# EAGLE design schematic (EAGLE 6.4)
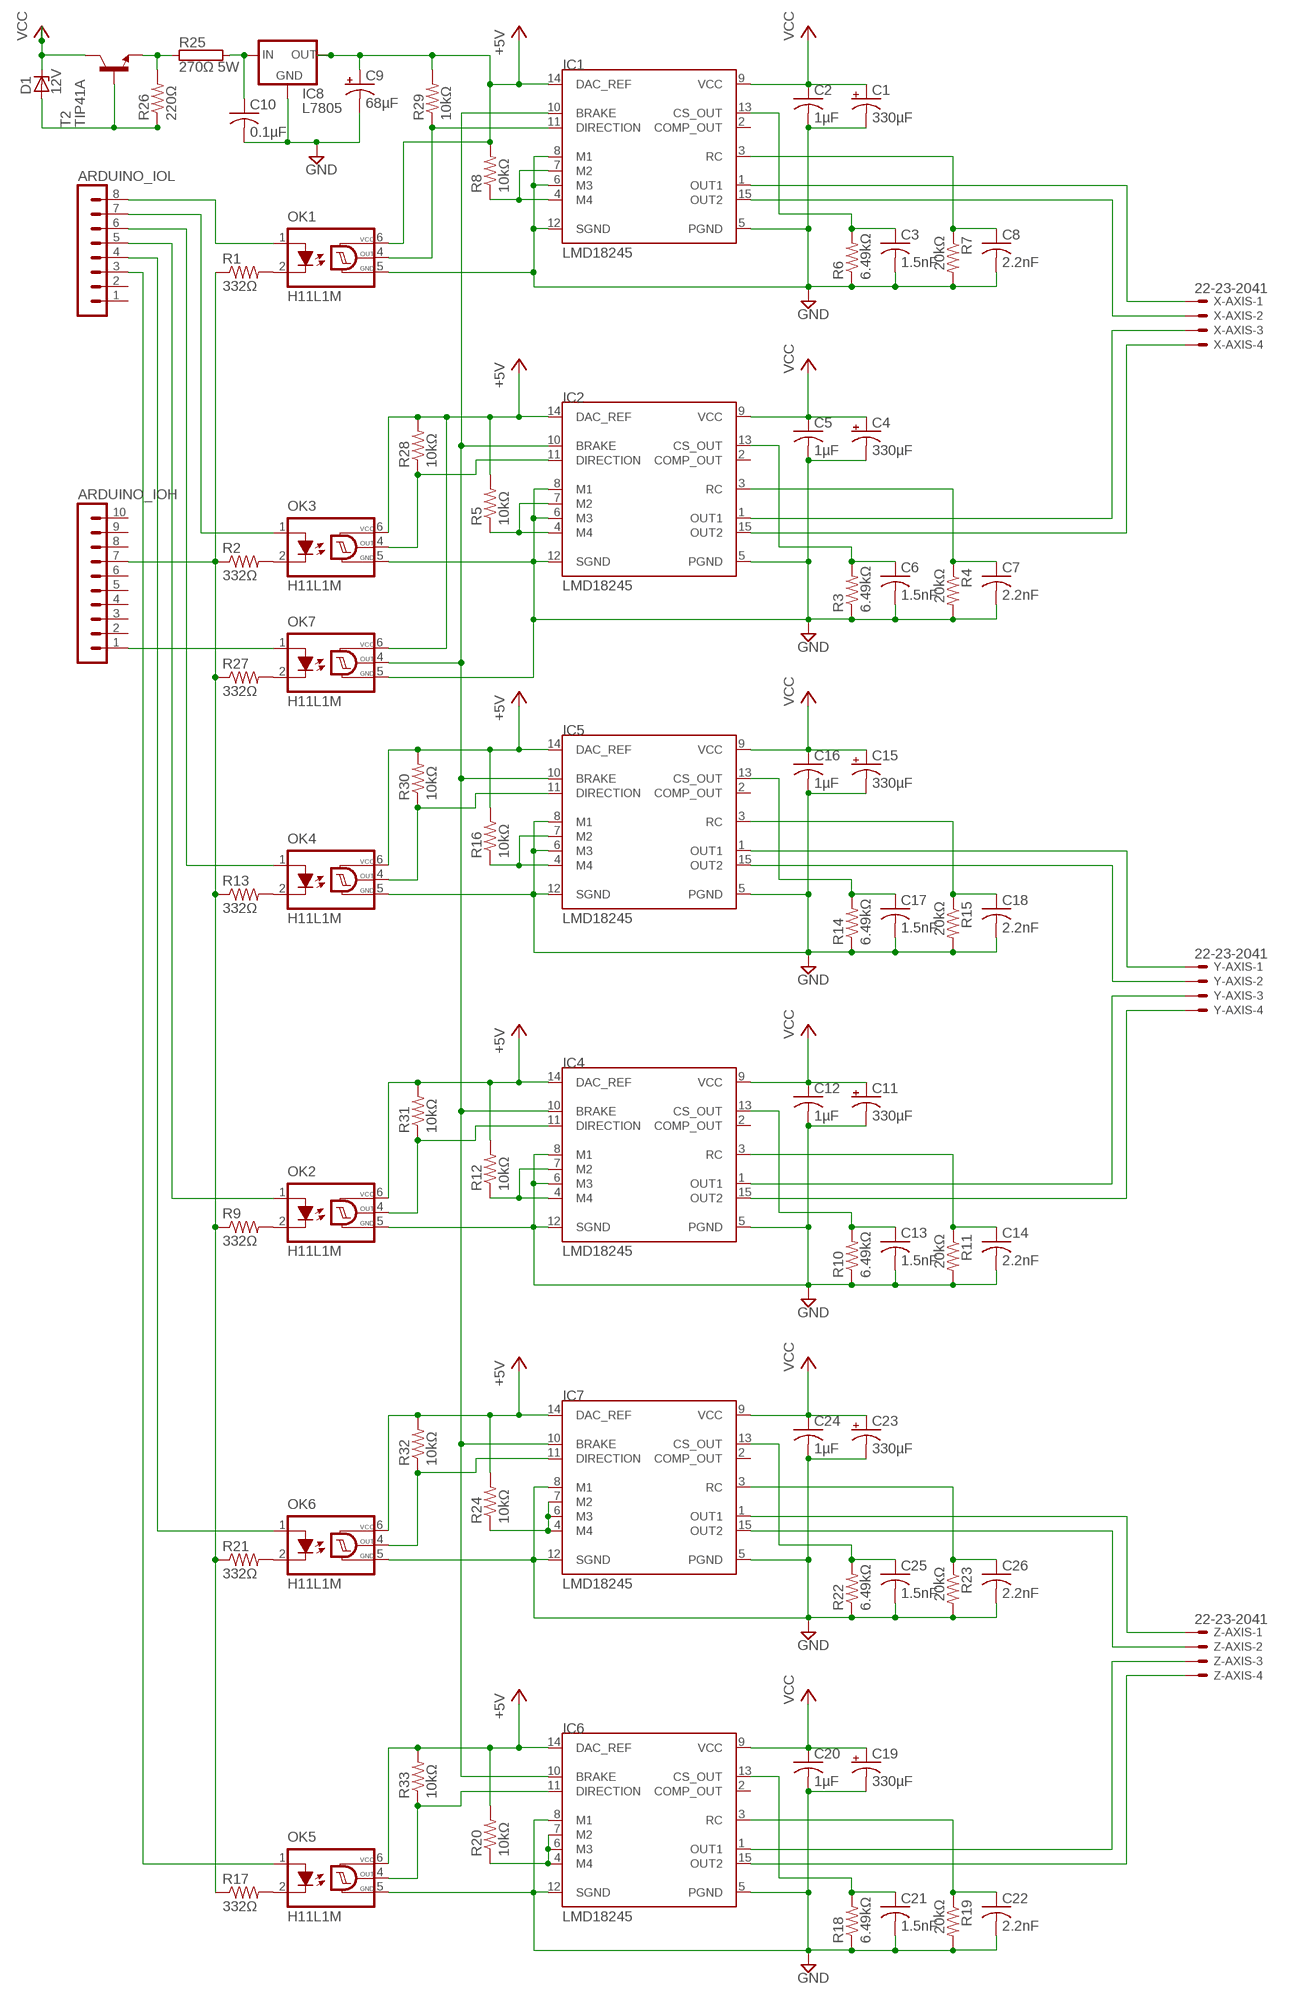
[diagram p0: schematic, sheet 1]

## Parts
ARDUINO_IOH  MA10-1  [MA10-1]
ARDUINO_IOL  MA08-1  [MA08-1]
C1  330µF  CPOL-USE5-13  [E5-13]
C2  1µF  C-US050-024X044  [C050-024X044]
C3  1.5nF  C-US050-024X044  [C050-024X044]
C4  330µF  CPOL-USE5-13  [E5-13]
C5  1µF  C-US050-024X044  [C050-024X044]
C6  1.5nF  C-US050-024X044  [C050-024X044]
C7  2.2nF  C-US050-024X044  [C050-024X044]
C8  2.2nF  C-US050-024X044  [C050-024X044]
C9  68µF  CPOL-USE2.5-6  [E2,5-6]
C10  0.1µF  C-US102-054X133  [C102-054X133]
C11  330µF  CPOL-USE5-13  [E5-13]
C12  1µF  C-US050-024X044  [C050-024X044]
C13  1.5nF  C-US050-024X044  [C050-024X044]
C14  2.2nF  C-US050-024X044  [C050-024X044]
C15  330µF  CPOL-USE5-13  [E5-13]
C16  1µF  C-US050-024X044  [C050-024X044]
C17  1.5nF  C-US050-024X044  [C050-024X044]
C18  2.2nF  C-US050-024X044  [C050-024X044]
C19  330µF  CPOL-USE5-13  [E5-13]
C20  1µF  C-US050-024X044  [C050-024X044]
C21  1.5nF  C-US050-024X044  [C050-024X044]
C22  2.2nF  C-US050-024X044  [C050-024X044]
C23  330µF  CPOL-USE5-13  [E5-13]
C24  1µF  C-US050-024X044  [C050-024X044]
C25  1.5nF  C-US050-024X044  [C050-024X044]
C26  2.2nF  C-US050-024X044  [C050-024X044]
D1  12V  ZPY  [DO41Z10]
IC1  LMD18245  [MULTIWATT-15]
IC2  LMD18245  [MULTIWATT-15]
IC4  LMD18245  [MULTIWATT-15]
IC5  LMD18245  [MULTIWATT-15]
IC6  LMD18245  [MULTIWATT-15]
IC7  LMD18245  [MULTIWATT-15]
IC8  L7805  78XXS  [78XXS]
OK1  H11L1M  [DIL06]
OK2  H11L1M  [DIL06]
OK3  H11L1M  [DIL06]
OK4  H11L1M  [DIL06]
OK5  H11L1M  [DIL06]
OK6  H11L1M  [DIL06]
OK7  H11L1M  [DIL06]
R1  332Ω  R-US_0204/7  [0204/7]
R2  332Ω  R-US_0204/7  [0204/7]
R3  6.49kΩ  R-US_0204/7  [0204/7]
R4  20kΩ  R-US_0204/7  [0204/7]
R5  10kΩ  R-US_0204/7  [0204/7]
R6  6.49kΩ  R-US_0204/7  [0204/7]
R7  20kΩ  R-US_0204/7  [0204/7]
R8  10kΩ  R-US_0204/7  [0204/7]
R9  332Ω  R-US_0204/7  [0204/7]
R10  6.49kΩ  R-US_0204/7  [0204/7]
R11  20kΩ  R-US_0204/7  [0204/7]
R12  10kΩ  R-US_0204/7  [0204/7]
R13  332Ω  R-US_0204/7  [0204/7]
R14  6.49kΩ  R-US_0204/7  [0204/7]
R15  20kΩ  R-US_0204/7  [0204/7]
R16  10kΩ  R-US_0204/7  [0204/7]
R17  332Ω  R-US_0204/7  [0204/7]
R18  6.49kΩ  R-US_0204/7  [0204/7]
R19  20kΩ  R-US_0204/7  [0204/7]
R20  10kΩ  R-US_0204/7  [0204/7]
R21  332Ω  R-US_0204/7  [0204/7]
R22  6.49kΩ  R-US_0204/7  [0204/7]
R23  20kΩ  R-US_0204/7  [0204/7]
R24  10kΩ  R-US_0204/7  [0204/7]
R25  270Ω 5W  RHPS523  [HPS523]
R26  220Ω  R-US_0204/7  [0204/7]
R27  332Ω  R-US_0204/7  [0204/7]
R28  10kΩ  R-US_0204/7  [0204/7]
R29  10kΩ  R-US_0204/7  [0204/7]
R30  10kΩ  R-US_0204/7  [0204/7]
R31  10kΩ  R-US_0204/7  [0204/7]
R32  10kΩ  R-US_0204/7  [0204/7]
R33  10kΩ  R-US_0204/7  [0204/7]
T2  TIP41A  -NPN-TO202V  [TO202V]
X-AXIS  22-23-2041  [22-23-2041]
Y-AXIS  22-23-2041  [22-23-2041]
Z-AXIS  22-23-2041  [22-23-2041]

## Nets
+5V: C9.+ IC1.14(DAC_REF) IC2.14(DAC_REF) IC4.14(DAC_REF) IC5.14(DAC_REF) IC6.14(DAC_REF) IC7.14(DAC_REF) IC8.OUT OK1.6(VCC) OK2.6(VCC) OK3.6(VCC) OK4.6(VCC) OK5.6(VCC) OK6.6(VCC) OK7.6(VCC) R5.2 R8.2 R12.2 R16.2 R20.2 R24.2 R28.2 R29.2 R30.2 R31.2 R32.2 R33.2
GND: C1.- C2.2 C3.2 C4.- C5.2 C6.2 C7.2 C8.2 C9.- C10.2 C11.- C12.2 C13.2 C14.2 C15.- C16.2 C17.2 C18.2 C19.- C20.2 C21.2 C22.2 C23.- C24.2 C25.2 C26.2 IC1.5(PGND) IC1.6(M3) IC1.8(M1) IC1.12(SGND) IC2.5(PGND) IC2.6(M3) IC2.8(M1) IC2.12(SGND) IC4.5(PGND) IC4.6(M3) IC4.8(M1) IC4.12(SGND) IC5.5(PGND) IC5.6(M3) IC5.8(M1) IC5.12(SGND) IC6.5(PGND) IC6.8(M1) IC6.12(SGND) IC7.5(PGND) IC7.8(M1) IC7.12(SGND) IC8.GND OK1.5(GND) OK2.5(GND) OK3.5(GND) OK4.5(GND) OK5.5(GND) OK6.5(GND) OK7.5(GND) R3.1 R4.2 R6.1 R7.2 R10.1 R11.2 R14.1 R15.2 R18.1 R19.2 R22.1 R23.2
N$1: ARDUINO_IOH.7 R1.1 R2.1 R9.1 R13.1 R17.1 R21.1 R27.1
N$2: IC1.11(DIRECTION) OK1.4(OUT) R29.1
N$3: ARDUINO_IOL.8 OK1.1(A)
N$4: IC4.11(DIRECTION) OK2.4(OUT) R31.1
N$5: C3.1 IC1.13(CS_OUT) R6.2
N$6: IC2.4(M4) IC2.7(M2) R5.1
N$7: C8.1 IC1.3(RC) R7.1
N$8: IC1.4(M4) IC1.7(M2) R8.1
N$9: IC7.11(DIRECTION) OK6.4(OUT) R32.1
N$10: C6.1 IC2.13(CS_OUT) R3.2
N$11: ARDUINO_IOL.7 OK3.1(A)
N$12: C7.1 IC2.3(RC) R4.1
N$13: C13.1 IC4.13(CS_OUT) R10.2
N$14: C14.1 IC4.3(RC) R11.1
N$15: IC1.1(OUT1) X-AXIS.1
N$16: IC1.15(OUT2) X-AXIS.2
N$17: IC2.1(OUT1) X-AXIS.3
N$18: IC4.4(M4) IC4.7(M2) R12.1
N$19: IC5.11(DIRECTION) OK4.4(OUT) R30.1
N$20: IC2.15(OUT2) X-AXIS.4
N$21: OK3.2(C) R2.2
N$22: OK1.2(C) R1.2
N$23: C17.1 IC5.13(CS_OUT) R14.2
N$24: C18.1 IC5.3(RC) R15.1
N$25: IC5.4(M4) IC5.7(M2) R16.1
N$26: IC5.1(OUT1) Y-AXIS.1
N$27: IC5.15(OUT2) Y-AXIS.2
N$28: IC4.1(OUT1) Y-AXIS.3
N$29: IC4.15(OUT2) Y-AXIS.4
N$30: ARDUINO_IOL.5 OK2.1(A)
N$31: IC7.4(M4) IC7.6(M3) IC7.7(M2) R24.1
N$32: OK2.2(C) R9.2
N$33: OK4.2(C) R13.2
N$34: ARDUINO_IOL.6 OK4.1(A)
N$35: IC6.11(DIRECTION) OK5.4(OUT) R33.1
N$36: C21.1 IC6.13(CS_OUT) R18.2
N$37: C22.1 IC6.3(RC) R19.1
N$38: IC6.4(M4) IC6.6(M3) IC6.7(M2) R20.1
N$40: C25.1 IC7.13(CS_OUT) R22.2
N$41: C26.1 IC7.3(RC) R23.1
N$42: D1.A R26.1 T2.3(B)
N$43: IC7.1(OUT1) Z-AXIS.1
N$44: IC7.15(OUT2) Z-AXIS.2
N$45: IC6.1(OUT1) Z-AXIS.3
N$46: IC6.15(OUT2) Z-AXIS.4
N$47: ARDUINO_IOL.3 OK5.1(A)
N$48: R25.1 R26.2 T2.1(E)
N$49: OK5.2(C) R17.2
N$50: OK6.2(C) R21.2
N$51: ARDUINO_IOL.4 OK6.1(A)
N$52: C10.1 IC8.IN R25.2
N$53: OK7.2(C) R27.2
N$54: ARDUINO_IOH.1 OK7.1(A)
N$55: IC1.10(BRAKE) IC4.10(BRAKE) IC5.10(BRAKE) IC6.10(BRAKE) IC7.10(BRAKE) OK7.4(OUT)
N$56: IC2.11(DIRECTION) OK3.4(OUT) R28.1
VCC: C1.+ C2.1 C4.+ C5.1 C11.+ C12.1 C15.+ C16.1 C19.+ C20.1 C23.+ C24.1 D1.C IC1.9(VCC) IC2.9(VCC) IC4.9(VCC) IC5.9(VCC) IC6.9(VCC) IC7.9(VCC) T2.2(C)
Unconnected: ARDUINO_IOH.2 ARDUINO_IOH.3 ARDUINO_IOH.4 ARDUINO_IOH.5 ARDUINO_IOH.6 ARDUINO_IOH.8 ARDUINO_IOH.9 ARDUINO_IOH.10 ARDUINO_IOL.1 ARDUINO_IOL.2 IC1.2(COMP_OUT) IC2.2(COMP_OUT) IC2.10(BRAKE) IC4.2(COMP_OUT) IC5.2(COMP_OUT) IC6.2(COMP_OUT) IC7.2(COMP_OUT)

## Library data of the parts
ARDUINO_IOH = con-lstb:MA10-1: PIN HEADER; OC_FARNELL: unknown; OC_NEWARK: unknown
ARDUINO_IOL = con-lstb:MA08-1: PIN HEADER; OC_FARNELL: unknown; OC_NEWARK: unknown
C1 C4 C9 C11 C15 C19 C23 = resistor:CPOL-US: POLARIZED CAPACITOR, American symbol
C2 C3 C5-C8 C10 C12-C14 C16-C18 C20-C22 C24-C26 = resistor:C-US: CAPACITOR, American symbol
D1 = diode:ZPY: Z DIODE 1 W
IC1 IC2 IC4-IC7 = eagleLibrary:LMD18245: LMD18245 3A, 55V DMOS Full-Bridge Motor Driver; MF: Texas Instruments; MPN: LMD18245; OC_FARNELL: 1589425; OC_NEWARK: 32M1527
IC8 = v-reg:78XXS: VOLTAGE REGULATOR
OK1-OK7 = optocoupler:H11L*M: 6-Pin DIP Optocoupler Source: http://www.fairchildsemi.com/ds/H1/H11L2-M.pdf; MF: FAIRCHILD SEMICONDUCTOR; MPN: H11L1-M; OC_FARNELL: 1021127; OC_NEWARK: 72K8643
R1-R24 R26-R33 = resistor:R-US_: RESISTOR, American symbol
R25 = resistor-power:R: Power Resitor; OC_FARNELL: unknown; OC_NEWARK: unknown
T2 = transistor:*-NPN-: NPN Transistror BF959 corrected 2008.03.06
X-AXIS Y-AXIS Z-AXIS = con-molex:22-23-2041: .100" (2.54mm) Center Header - 4 Pin; MF: MOLEX; MPN: 22-23-2041; OC_FARNELL: 1462920; OC_NEWARK: 38C0355

## Board
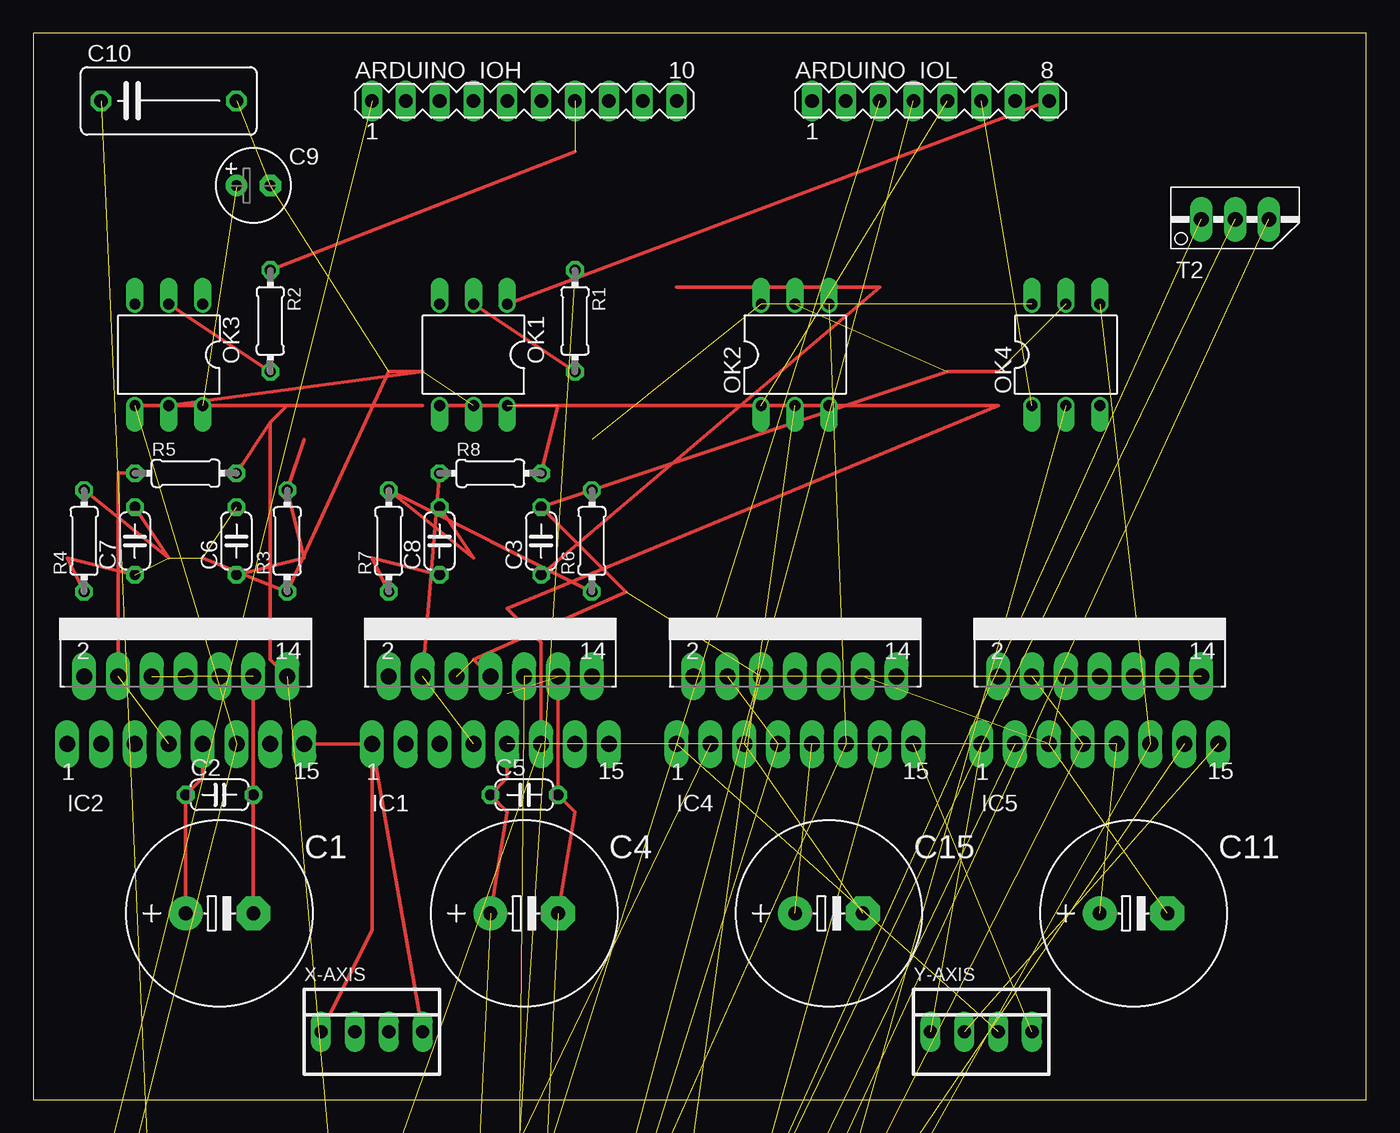
[diagram p1: board, top side]
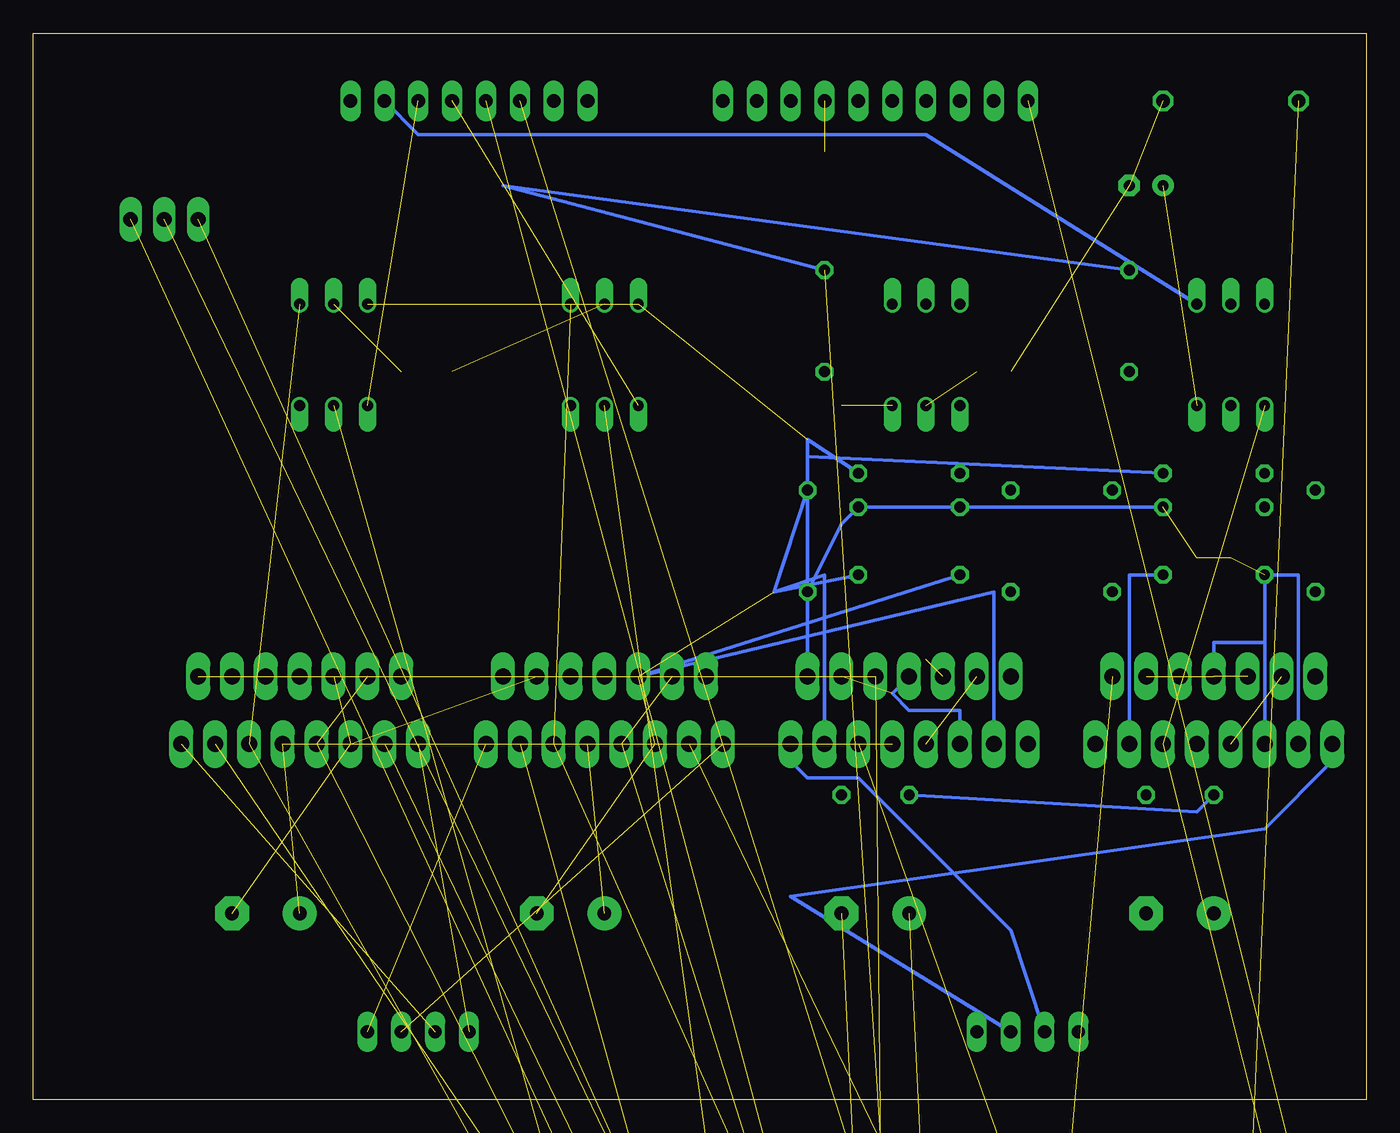
[diagram p2: board, bottom side, seen from below]

Size 100 x 80 mm. Coordinates in mm from the lower left corner, seen from the top.
Outline: 0,0 100,0 100,80 0,80 0,0
Copper layers (1*16): Top 0.035mm / dielectric 1.5mm / Bottom 0.035mm
Design rules "default": minimum track width 10mil, minimum drill 24mil, track to track 8mil, track to pad 8mil, pad to pad 8mil, via to via 8mil, smd to smd 8mil, copper to edge 40mil, drill to drill 8mil, minimum pad ring 10mil, minimum via ring 8mil, stop-mask expansion 4mil, vias tented up to drill 0mil, thermal gap 10mil

### Footprints (pad centres in the part's own frame; a part is rotated, then mirrored left to right if it is on the bottom)
MA10-1 = drill 1.016 long: 1 -11.43,0; 2 -8.89,0; 3 -6.35,0; 4 -3.81,0; 5 -1.27,0; 6 1.27,0; 7 3.81,0; 8 6.35,0; 9 8.89,0; 10 11.43,0
MA08-1 = drill 1.016 long: 1 -8.89,0; 2 -6.35,0; 3 -3.81,0; 4 -1.27,0; 5 1.27,0; 6 3.81,0; 7 6.35,0; 8 8.89,0
E5-13 = drill 1.016 pad 2.54: + -2.54,0 | drill 1.016 pad 2.54 octagon: - 2.54,0
C050-024X044 = drill 0.813 octagon: 1 -2.54,0; 2 2.54,0
E2,5-6 = drill 0.813 pad 1.6: + -1.27,0 | drill 0.813 pad 1.6 octagon: - 1.27,0
C102-054X133 = drill 1.016 octagon: 1 -5.08,0; 2 5.08,0
DO41Z10 = drill 1.118: A 5.08,0; C -5.08,0
MULTIWATT-15 = drill 1.2 long: 1 -8.89,-7.62; 2 -7.62,-2.54; 3 -6.35,-7.62; 4 -5.08,-2.54; 5 -3.81,-7.62; 6 -2.54,-2.54; 7 -1.27,-7.62; 8 0,-2.54; 9 1.27,-7.62; 10 2.54,-2.54; 11 3.81,-7.62; 12 5.08,-2.54; 13 6.35,-7.62; 14 7.62,-2.54; 15 8.89,-7.62
78XXS = drill 1.016 long: GND 0,-2.54; IN -2.54,-2.54; OUT 2.54,-2.54
DIL06 = drill 0.813 offset: 1 -2.54,-3.81; 2 0,-3.81; 3 2.54,-3.81; 4 2.54,3.81; 5 0,3.81; 6 -2.54,3.81
0204/7 = drill 0.813 octagon: 1 -3.81,0; 2 3.81,0
HPS523 = drill 1.1 pad 1.7: 1 -13.97,0; 2 13.97,0
TO202V = drill 1.118 long: 1 -2.54,-2.54; 2 0,-2.54; 3 2.54,-2.54
22-23-2041 = drill 1 long: 1 -3.81,0; 2 -1.27,0; 3 1.27,0; 4 3.81,0

### Placement (x,y rotation side)
ARDUINO_IOH  36.83,74.93 0 top
ARDUINO_IOL  67.31,74.93 0 top
C1  13.97,13.97 0 top
C2  13.97,22.86 0 top
C3  38.1,41.91 90 top
C4  36.83,13.97 0 top
C5  36.83,22.86 0 top
C6  15.24,41.91 90 top
C7  7.62,41.91 90 top
C8  30.48,41.91 90 top
C9  16.51,68.58 0 top
C10  10.16,74.93 0 top
C11  82.55,13.97 0 top
C12  33.02,-64.77 0 top  (outside the outline)
C13  40.64,-64.77 0 top  (outside the outline)
C14  3.81,-76.2 0 top  (outside the outline)
C15  59.69,13.97 0 top
C16  11.43,-76.2 0 top  (outside the outline)
C17  19.05,-76.2 0 top  (outside the outline)
C18  26.67,-76.2 0 top  (outside the outline)
C19  6.35,-123.19 0 top  (outside the outline)
C20  33.02,-120.65 0 top  (outside the outline)
C21  40.64,-120.65 0 top  (outside the outline)
C22  3.81,-132.08 0 top  (outside the outline)
C23  20.32,-123.19 0 top  (outside the outline)
C24  11.43,-132.08 0 top  (outside the outline)
C25  19.05,-132.08 0 top  (outside the outline)
C26  26.67,-132.08 0 top  (outside the outline)
D1  -7.62,-147.32 0 top  (outside the outline)
IC1  34.29,34.29 0 top
IC2  11.43,34.29 0 top
IC4  57.15,34.29 0 top
IC5  80.01,34.29 0 top
IC6  10.16,-90.17 0 top  (outside the outline)
IC7  33.02,-90.17 0 top  (outside the outline)
IC8  -33.02,-200.66 0 top  (outside the outline)
OK1  33.02,55.88 180 top
OK2  57.15,55.88 0 top
OK3  10.16,55.88 180 top
OK4  77.47,55.88 0 top
OK5  6.35,-110.49 0 top  (outside the outline)
OK6  17.78,-110.49 0 top  (outside the outline)
OK7  -33.02,-165.1 0 top  (outside the outline)
R1  40.64,58.42 270 top
R2  17.78,58.42 270 top
R3  19.05,41.91 90 top
R4  3.81,41.91 90 top
R5  11.43,46.99 0 top
R6  41.91,41.91 90 top
R7  26.67,41.91 90 top
R8  34.29,46.99 0 top
R9  35.56,-76.2 0 top  (outside the outline)
R10  5.08,-82.55 0 top  (outside the outline)
R11  15.24,-82.55 0 top  (outside the outline)
R12  25.4,-82.55 0 top  (outside the outline)
R13  35.56,-82.55 0 top  (outside the outline)
R14  5.08,-86.36 0 top  (outside the outline)
R15  15.24,-86.36 0 top  (outside the outline)
R16  25.4,-86.36 0 top  (outside the outline)
R17  35.56,-132.08 0 top  (outside the outline)
R18  5.08,-138.43 0 top  (outside the outline)
R19  15.24,-138.43 0 top  (outside the outline)
R20  25.4,-138.43 0 top  (outside the outline)
R21  35.56,-138.43 0 top  (outside the outline)
R22  5.08,-142.24 0 top  (outside the outline)
R23  15.24,-142.24 0 top  (outside the outline)
R24  25.4,-142.24 0 top  (outside the outline)
R25  1.27,-156.21 0 top  (outside the outline)
R26  -8.89,-162.56 0 top  (outside the outline)
R27  -33.02,-176.53 0 top  (outside the outline)
R28  -33.02,-180.34 0 top  (outside the outline)
R29  -33.02,-184.15 0 top  (outside the outline)
R30  -33.02,-187.96 0 top  (outside the outline)
R31  -33.02,-191.77 0 top  (outside the outline)
R32  -33.02,-195.58 0 top  (outside the outline)
R33  -33.02,-199.39 0 top  (outside the outline)
T2  90.17,68.58 0 top
X-AXIS  25.4,5.08 0 top
Y-AXIS  71.12,5.08 0 top
Z-AXIS  29.21,-109.22 0 top  (outside the outline)

### Tracks (layer width: path | path; a pad name or v marks a point on that pad's centre or on a via)
+5V  (22 unrouted)
  Top 0.254: 17.78,50.8 19.05,52.07 OK3.6 | 17.78,50.8 R5.2 | IC2.14 17.78,33.02 17.78,50.8 | 39.37,52.07 R8.2
  Bottom 0.254: 41.91,48.26 41.91,49.53 R8.2 | 41.91,48.26 IC1.14 | 41.91,48.26 R5.2
GND  (54 unrouted)
  Top 0.254: 12.7,40.64 R3.1 26.67,54.61 29.21,54.61 OK3.5 | C1.- C2.2 IC2.12 | C4.- 40.64,21.59 C5.2 IC1.12 | C8.2 33.02,40.64 R7.2 R6.1 | 72.39,54.61 68.58,54.61 C3.2 44.45,38.1 33.02,33.02 IC1.8 | C7.2 10.16,40.64 R4.2
  Bottom 0.254: 7.62,39.37 7.62,34.29 | 7.62,34.29 IC2.5 | IC2.8 11.43,34.29 7.62,34.29 | IC1.5 30.48,29.21 34.29,29.21 35.56,30.48 IC1.8 | R6.1 39.37,43.18 C3.2 C6.2
N$1  (6 unrouted)
  Top 0.254: 40.64,71.12 R2.1
  Bottom 0.254: R1.1 64.77,68.58 R2.1
N$2  (1 unrouted)
  Top 0.254: OK1.4 72.39,52.07 35.56,36.83 38.1,34.29 IC1.11
N$3
  Top 0.254: ARDUINO_IOL.8 OK1.1
N$4  (2 unrouted)
N$5
  Top 0.254: 48.26,60.96 63.5,60.96 C3.1
  Bottom 0.254: 44.45,38.1 C3.1 | R6.2 44.45,38.1 | IC1.13 40.64,39.37 44.45,38.1
N$6  (1 unrouted)
  Top 0.254: R5.1 6.35,46.99 IC2.4
N$7
  Top 0.254: C8.1 25.4,40.64 R7.1
  Bottom 0.254: IC1.3 27.94,38.1 54.61,31.75 C8.1
N$8  (1 unrouted)
  Top 0.254: IC1.4 R8.1
N$9  (2 unrouted)
N$10
  Top 0.254: C6.1 20.32,40.64 R3.2 20.32,49.53
  Bottom 0.254: IC2.13 17.78,39.37 C6.1
N$11
  Bottom 0.254: OK3.1 33.02,72.39 71.12,72.39 ARDUINO_IOL.7
N$12
  Top 0.254: C7.1 2.54,40.64 R4.1
  Bottom 0.254: IC2.3 5.08,39.37 C7.1
N$13  (2 unrouted)
N$14  (2 unrouted)
N$15
  Top 0.254: X-AXIS.1 25.4,12.7 IC1.1
N$16
  Bottom 0.254: X-AXIS.2 26.67,12.7 38.1,24.13 41.91,24.13 43.18,25.4 IC1.15
N$17
  Bottom 0.254: X-AXIS.3 43.18,15.24 7.62,20.32 2.54,25.4 IC2.1
N$18  (2 unrouted)
N$19  (2 unrouted)
N$20
  Top 0.254: X-AXIS.4 25.4,26.67 IC2.15
N$21
  Top 0.254: R2.2 OK3.2
N$22
  Top 0.254: R1.2 OK1.2
N$23  (2 unrouted)
N$24  (2 unrouted)
N$25  (2 unrouted)
N$26  (1 unrouted)
N$27  (1 unrouted)
N$28  (1 unrouted)
N$29  (1 unrouted)
N$30  (1 unrouted)
N$31  (3 unrouted)
N$32  (1 unrouted)
N$33  (1 unrouted)
N$34  (1 unrouted)
N$35  (2 unrouted)
N$36  (2 unrouted)
N$37  (2 unrouted)
N$38  (3 unrouted)
N$40  (2 unrouted)
N$41  (2 unrouted)
N$42  (2 unrouted)
N$43  (1 unrouted)
N$44  (1 unrouted)
N$45  (1 unrouted)
N$46  (1 unrouted)
N$47  (1 unrouted)
N$48  (2 unrouted)
N$49  (1 unrouted)
N$50  (1 unrouted)
N$51  (1 unrouted)
N$52  (2 unrouted)
N$53  (1 unrouted)
N$54  (1 unrouted)
N$55  (5 unrouted)
N$56  (2 unrouted)
  Top 0.254: 29.21,52.07 OK3.4
VCC  (14 unrouted)
  Top 0.254: IC1.9 35.56,24.13 C5.1 35.56,21.59 C4.+ | IC2.9 12.7,24.13 C2.1 C1.+
  Bottom 0.254: C5.1 12.7,21.59 C2.1